# Altium schematic sheet mpc57_cover.SchDoc: <Enter Title>
size B; DrawnBy: <Drawn By>; Organization: My Company; Address1: 123 Main St; Address2: San Diego, CA 92123; Address3: (619) 616-6873; Revision: <Enter Revision>; SheetNumber: #; SheetTotal: #
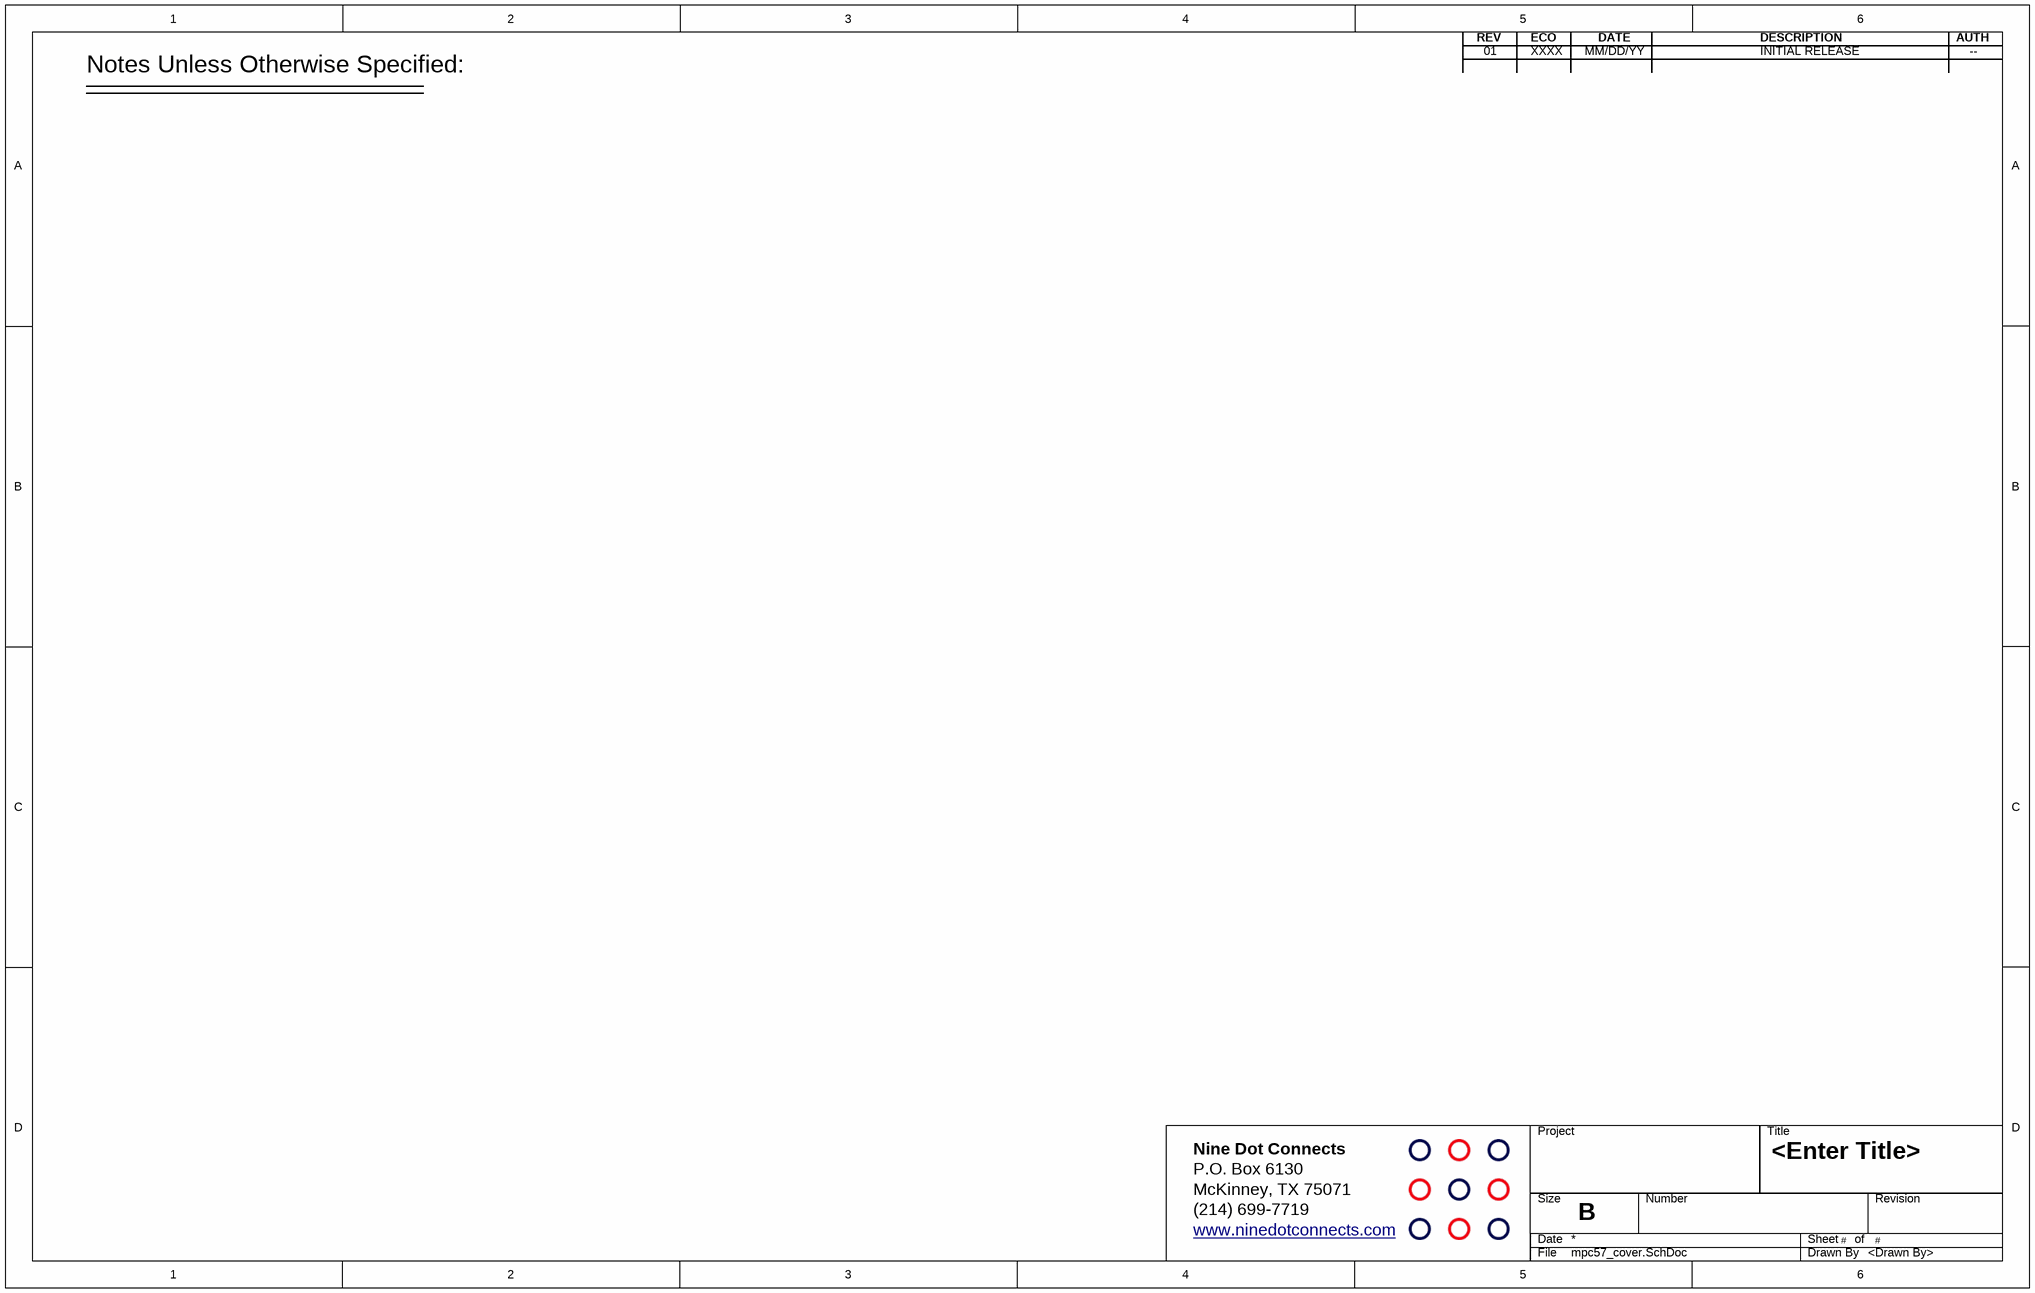
[diagram p0: mpc57_cover.SchDoc]

## Notes on the sheet
- Notes Unless Otherwise Specified:
- REV
- 01
- ECO
- XXXX
- MM/DD/YY
- DATE
- DESCRIPTION
- INITIAL RELEASE
- AUTH
- --
- Nine Dot Connects
- P.O. Box 6130
- Project
- Title
- McKinney, TX 75071
- (214) 699-7719
- www.ninedotconnects.com <http://lmgtfy.com/?q=How+to+register+a+domain+name>
- Date
- Size
- B
- Number
- Sheet
- of
- Revision
- File
- Drawn By